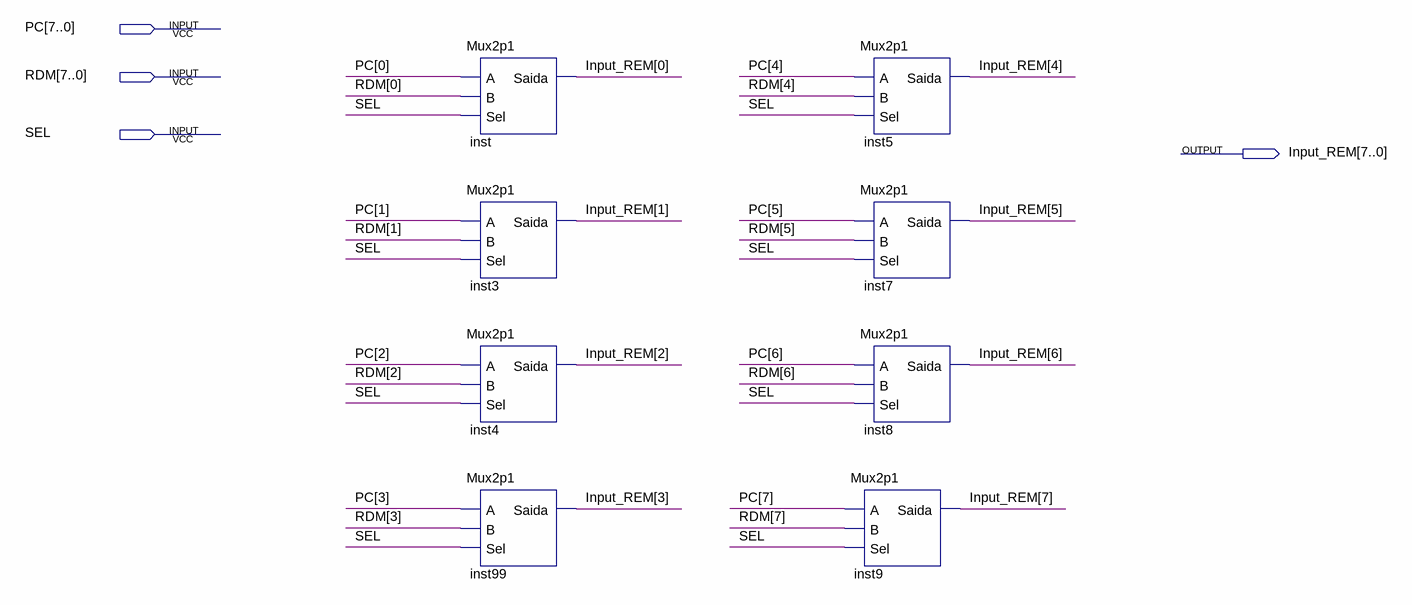
[diagram p0: schematic sheet]
// Quartus schematic MUX8bits_2p1.bdf as structural Verilog: 8 symbols, 4 pins
module MUX8bits_2p1 (
  input  [7:0] PC,
  input  [7:0] RDM,
  input  SEL,
  output [7:0] Input_REM
);

  Mux2p1 inst (.A(PC[0]), .B(RDM[0]), .Sel(SEL), .Saida(Input_REM[0]));
  Mux2p1 inst3 (.A(PC[1]), .B(RDM[1]), .Sel(SEL), .Saida(Input_REM[1]));
  Mux2p1 inst4 (.A(PC[2]), .B(RDM[2]), .Sel(SEL), .Saida(Input_REM[2]));
  Mux2p1 inst99 (.A(PC[3]), .B(RDM[3]), .Sel(SEL), .Saida(Input_REM[3]));
  Mux2p1 inst5 (.A(PC[4]), .B(RDM[4]), .Sel(SEL), .Saida(Input_REM[4]));
  Mux2p1 inst7 (.A(PC[5]), .B(RDM[5]), .Sel(SEL), .Saida(Input_REM[5]));
  Mux2p1 inst8 (.A(PC[6]), .B(RDM[6]), .Sel(SEL), .Saida(Input_REM[6]));
  Mux2p1 inst9 (.A(PC[7]), .B(RDM[7]), .Sel(SEL), .Saida(Input_REM[7]));
endmodule
